# EasyEDA schematic Grafiskas_plates_shema_ZPD_KB.json
TITLE: Ģitāras pedāļa grafiskās shēmas; REV: 1.0; Date: 2023-10-24; Sheet: 1/1; Drawn By: kristapsB; Company: Kristaps Bukšs
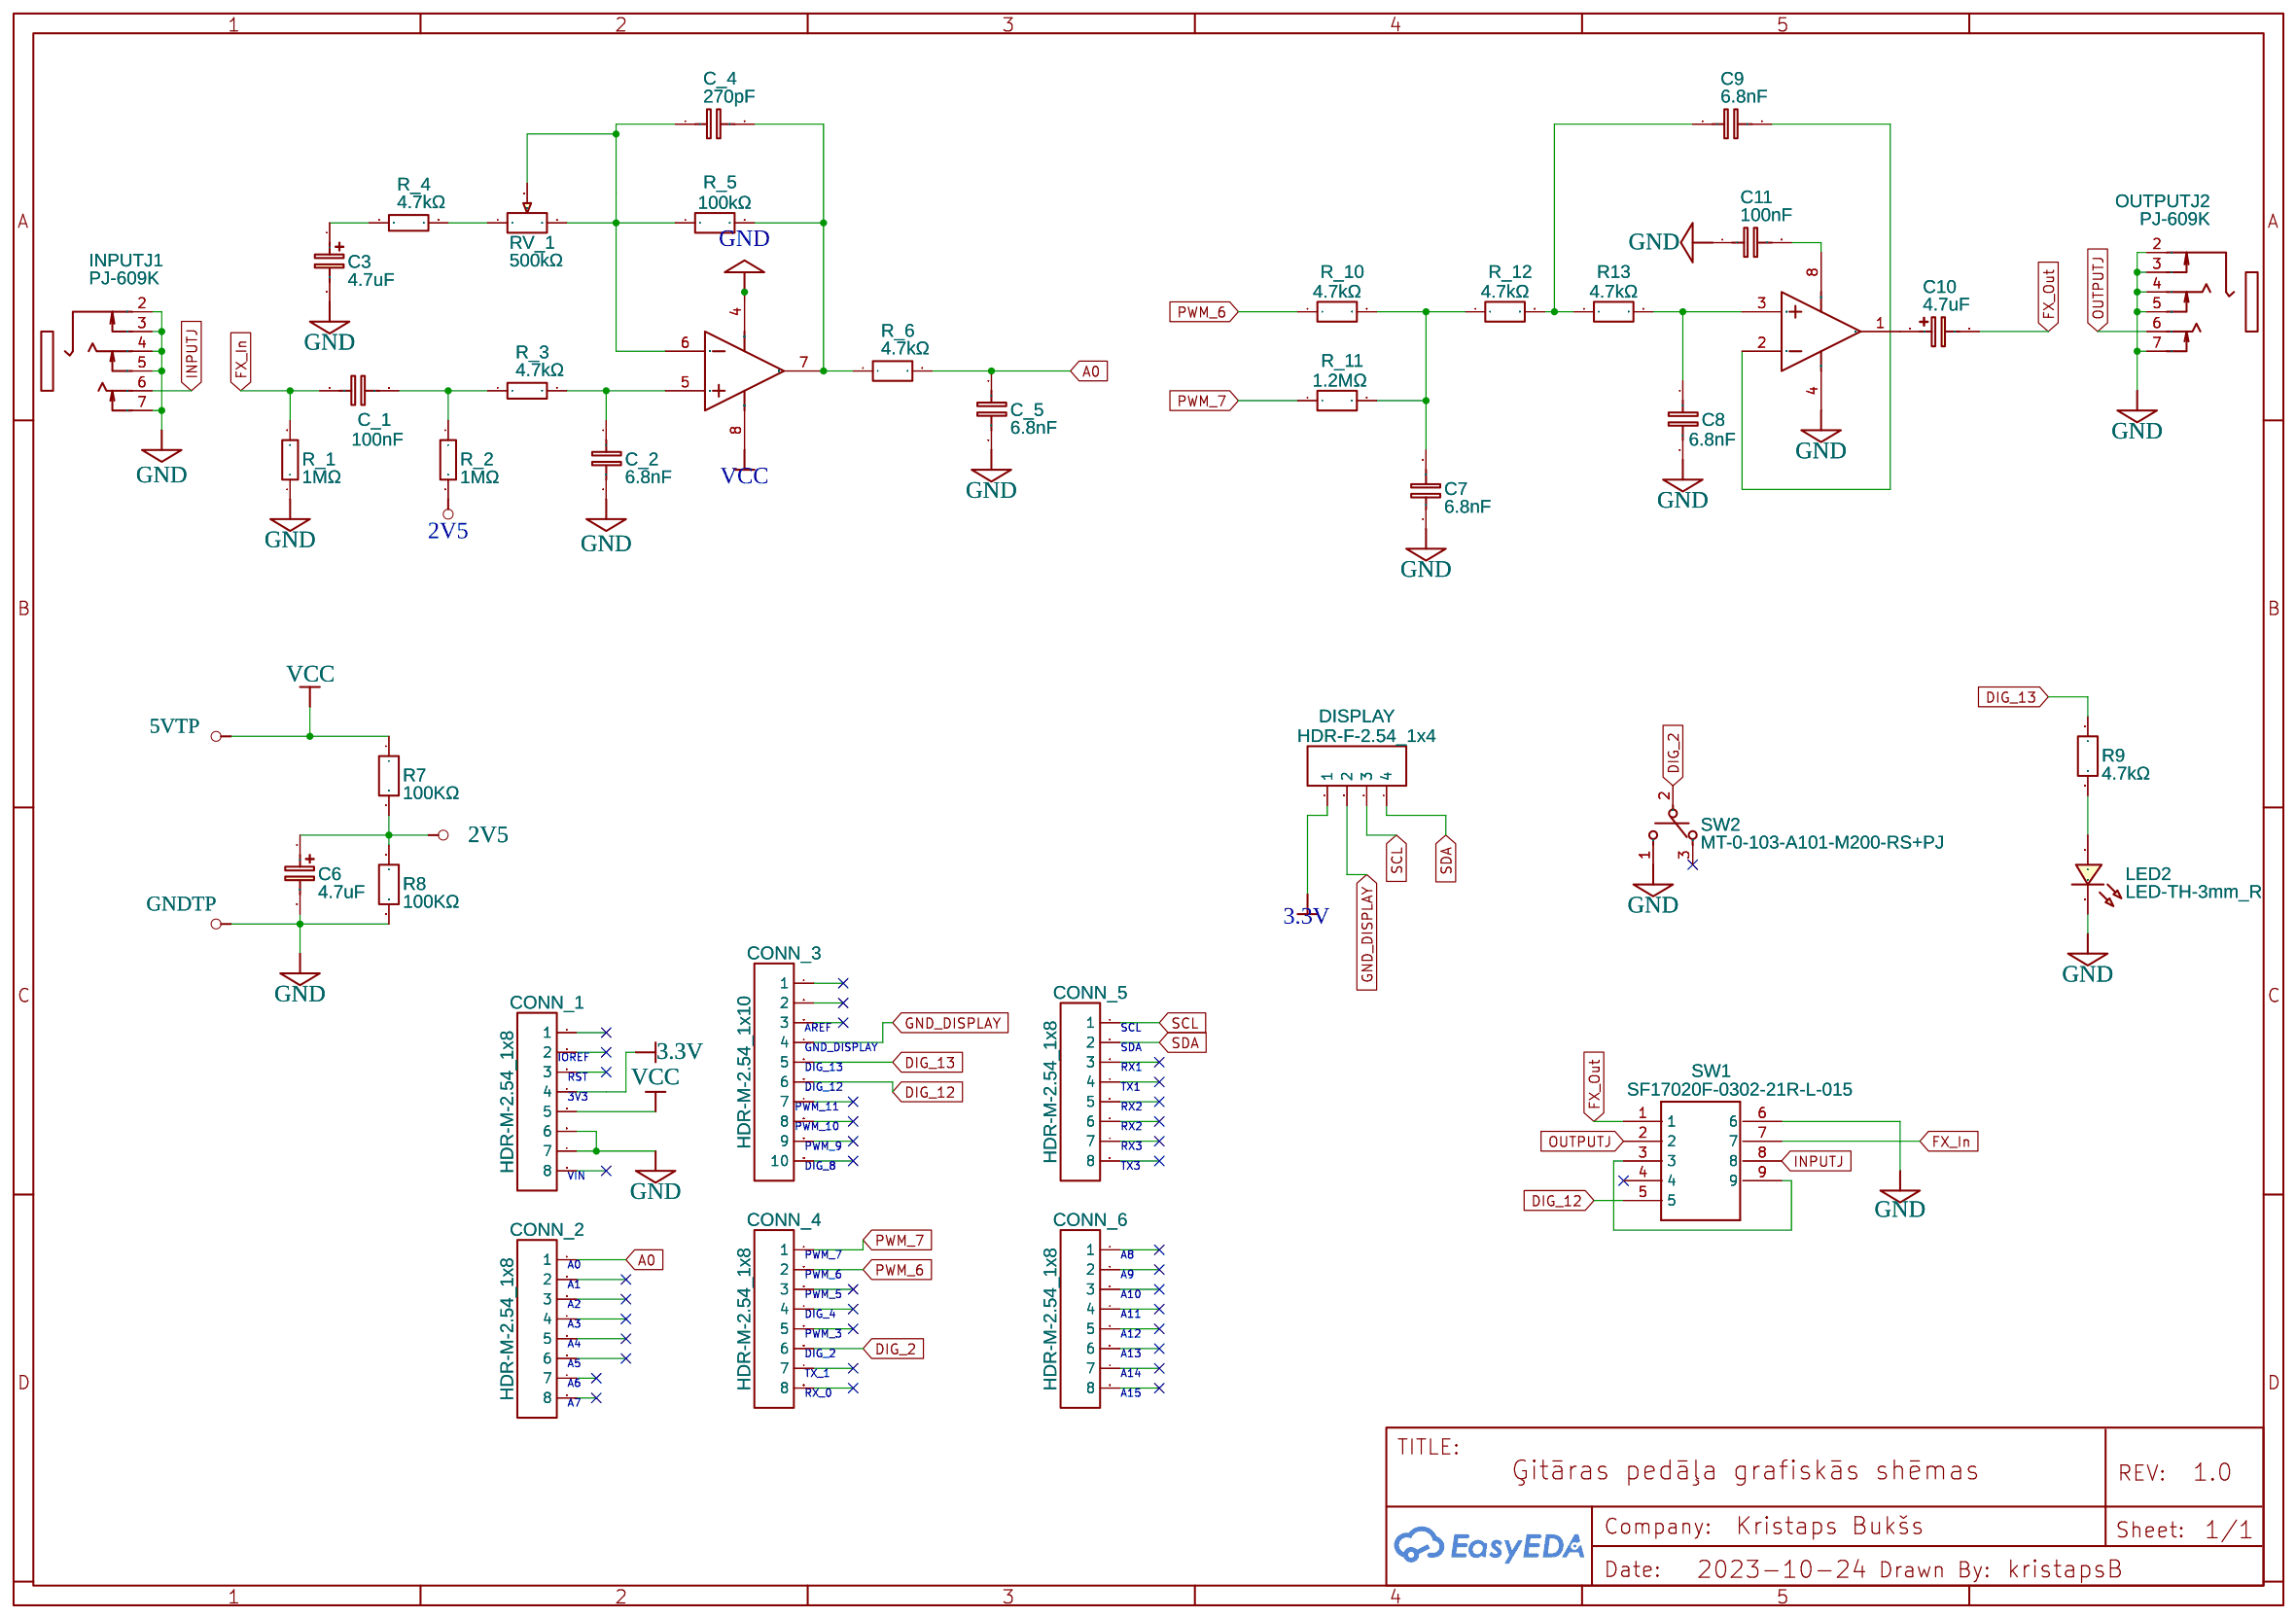
[diagram p0: schematic sheet]

## Parts
C3  4.7uF  [CAP-D6.3×H5.5]
C6  4.7uF  [CAP-D6.3×H5.5]
C7  6.8nF  [C0603]
C8  6.8nF  [C0603]
C9  6.8nF  [C0603]
C10  4.7uF  [CAP-D6.3×H5.5]
C11  100nF  [C0603]
C_1  100nF  [C0603]
C_2  6.8nF  [C0603]
C_4  270pF  [C0603]
C_5  6.8nF  [C0603]
CONN_1  HDR-M-2.54_1x8  [HDR-M-2.54_1X8]
CONN_2  HDR-M-2.54_1x8  [HDR-M-2.54_1X8]
CONN_3  HDR-M-2.54_1x10  [HDR-M-2.54_1X10]
CONN_4  HDR-M-2.54_1x8  [HDR-M-2.54_1X8]
CONN_5  HDR-M-2.54_1x8  [HDR-M-2.54_1X8]
CONN_6  HDR-M-2.54_1x8  [HDR-M-2.54_1X8]
DISPLAY  HDR-F-2.54_1x4  [HDR-F-2.54_1X4]
INPUTJ1  PJ-609K  [AUDIO-TH_PJ-609K]
LED2  LED-TH-3mm_R  [LED-TH_BD3.0_RED]
OUTPUTJ2  PJ-609K  [AUDIO-TH_PJ-609K]
R7  100KΩ  [R0603]
R8  100KΩ  [R0603]
R9  4.7kΩ  [R0603]
R13  4.7kΩ  [R0603]
R_1  1MΩ  [R0603]
R_2  1MΩ  [R0603]
R_3  4.7kΩ  [R0603]
R_4  4.7kΩ  [R0603]
R_5  100kΩ  [R0603]
R_6  4.7kΩ  [R0603]
R_10  4.7kΩ  [R0603]
R_11  1.2MΩ  [R0603]
R_12  4.7kΩ  [R0603]
RV_1  500kΩ  [RES-ADJ-TH_3386P]
SW1  SF17020F-0302-21R-L-015  [SF17020F030221RL015]
SW2  MT-0-103-A101-M200-RS+PJ  [SW-TH_MT-0-103-A101-M200-RS]
U5  TL972IPE4  [DIP8]  (sections 1,2)

## Library data of the parts
C3 C6 C10 = CE_SMD_D6.3×H5.5_EU: Contributor: LCEDA_Lib; Supplier Part: C111600; Supplier: LCSC; Manufacturer Part: UWX1C101MCL1GB; Manufacturer: Nichicon(尼吉康)
C7-C9 = C_0603_EU: Supplier Part: C2835383; Supplier: LCSC; Contributor: LCEDA_Lib; Manufacturer Part: CGA3E2C0G1H682JT0Y0N; Manufacturer: TDK
C11 C_1 = C_0603_EU: Supplier Part: C24452; Supplier: LCSC; Contributor: LCEDA_Lib; Manufacturer Part: CL10B104JB8NNNC; Manufacturer: SAMSUNG(三星)
C_2 C_5 = C_0603_EU: Supplier Part: C432939; Supplier: LCSC; Contributor: LCEDA_Lib; Manufacturer Part: CGA3E1C0G2A682JT0Y0E; Manufacturer: TDK
C_4 = C_0603_EU: Supplier Part: C376824; Supplier: LCSC; Contributor: LCEDA_Lib; Manufacturer Part: TCC0603X7R271K500CT; Manufacturer: CCTC(三环)
CONN_1 CONN_2 CONN_4-CONN_6 = HDR-M-2.54_1x8: Supplier Part: C190820; Supplier: LCSC; Contributor: LCEDA_Lib
CONN_3 = HDR-M-2.54_1x10: Supplier Part: C57369; Supplier: LCSC; Contributor: LCEDA_Lib
DISPLAY = HDR-F-2.54_1x4: Supplier Part: C225501; Supplier: LCSC; Contributor: LCEDA_Lib
INPUTJ1 OUTPUTJ2 = PJ-609K: Contributor: LCSC; Supplier: LCSC; Supplier Part: C309276; Manufacturer: HOOYA; JLCPCB Part Class: Extended Part; link: https://lcsc.com/eda_search?q=C309276&%26type=1&ref=editor
LED2 = LED-TH-3mm_R: Manufacturer: EVERLIGHT(台湾亿光); Manufacturer Part: 204-10SDRD/S530-A3-L; Supplier Part: C84774; Supplier: LCSC; Contributor: LCEDA_Lib
R7 R8 = R_0603_EU: Supplier Part: C312247; Supplier: LCSC; Contributor: LCEDA_Lib; Manufacturer Part: RTT031003BTP; Manufacturer: RALEC(旺诠)
R9 R13 R_10 R_12 = R_0603_EU: Supplier Part: C2904521; Supplier: LCSC; Contributor: LCEDA_Lib; Manufacturer Part: HoLTT0603-1/10W-4.7K-1%; Manufacturer: Milliohm(毫欧)
R_1 R_2 = 0603WAF1004T5E: Supplier: LCSC; Manufacturer: YAGEO(国巨); Manufacturer Part: RC0603JR-071ML; Supplier Part: C107698; JLCPCB Part Class: Basic Part; link: https://lcsc.com/eda_search?q=C22935&%26type=1&ref=editor
R_3 R_4 = 0603WAF4701T5E: Supplier: LCSC; Manufacturer: Milliohm(毫欧); Manufacturer Part: HoLTT0603-1/10W-4.7K-1%; Supplier Part: C2904521; JLCPCB Part Class: Basic Part; link: https://lcsc.com/eda_search?q=C23162&%26type=1&ref=editor
R_5 = SCR0603F100K: Contributor: lcsc; Supplier: LCSC; Supplier Part: C312247; Manufacturer: RALEC(旺诠); Manufacturer Part: RTT031003BTP; JLCPCB Part Class: Extended Part; link: https://lcsc.com/eda_search?q=C3016388&%26type=1&ref=editor
R_6 = R_0603_EU: Contributor: LCEDA_Lib
R_11 = R_0603_EU: Supplier Part: C228147; Supplier: LCSC; Contributor: LCEDA_Lib; Manufacturer Part: AC0603JR-071M2L; Manufacturer: YAGEO(国巨)
RV_1 = R_3386P_EU: Supplier Part: C72529; Supplier: LCSC; Manufacturer Part: 3362P-1-504LF; Contributor: LCEDA_Lib; Value(Ω): 10K; Manufacturer: BOURNS
SW1 = SF17020F-0302-21R-L-015: Contributor: kristaps1
SW2 = MT-0-103-A101-M200-RS+PJ: Contributor: LCSC; Supplier: LCSC; Supplier Part: C1788493; Manufacturer: YUEN FUNG(源丰); JLCPCB Part Class: Extended Part; link: https://lcsc.com/eda_search?q=C1788493&%26type=1&ref=editor
U5 = TL972IPE4: Output Rail-To-Rail Very-Low-Noise Operational Amplifier, 2.7 to 12 V, -40 to 125 degC, 8-pin DIP (P8), Pb-Free (RoHS); subpart_no: 1

## Nets
2V5: C6.1 R7.2 R8.1 R_2.2
3.3V: CONN_1.4 DISPLAY.1
5VTP: CONN_1.5 R7.1
GND: C3.2 C6.2 C7.1 C8.2 C11.1 C_2.2 C_5.2 CONN_1.6 CONN_1.7 INPUTJ1.2 INPUTJ1.3 INPUTJ1.4 INPUTJ1.5 INPUTJ1.7 LED2.2 OUTPUTJ2.2 OUTPUTJ2.3 OUTPUTJ2.4 OUTPUTJ2.5 OUTPUTJ2.7 R8.2 R_1.1 SW1.6 SW2.1 U5.4(VCC+)
GND_DISPLAY: CONN_3.4 DISPLAY.2
A0: C_5.1 CONN_2.1 R_6.2
DIG_2: CONN_4.6 SW2.2
DIG_12: CONN_3.6 SW1.5
DIG_13: CONN_3.5 R9.1
FX_In: C_1.1 R_1.2 SW1.7
FX_Out: C10.2 SW1.1
INPUTJ: INPUTJ1.6 SW1.8
OUTPUTJ: OUTPUTJ2.6 SW1.2
PWM_6: CONN_4.2 R_10.1
PWM_7: CONN_4.1 R_11.1
SCL: CONN_5.1 DISPLAY.3
SDA: CONN_5.2 DISPLAY.4
Net-(C3-1): C3.1 R_4.1
Net-(C7-2): C7.2 R_10.2 R_11.2 R_12.1
Net-(C8-1): C8.1 R13.2 U5.3(IN1+)
Net-(C9-1): C9.1 R13.1 R_12.2
Net-(C9-2): C9.2 U5.2(IN1-)
Net-(C10-1): C10.1 U5.1(OUT1)
Net-(C11-2): C11.2 U5.8(VCC-)
Net-(C_1-2): C_1.2 R_2.1 R_3.1
Net-(C_2-1): C_2.1 R_3.2 U5.5(IN2+)
Net-(C_4-1): C_4.1 R_5.1 RV_1.2 RV_1.3 U5.6(IN2-)
Net-(C_4-2): C_4.2 R_5.2 R_6.1 U5.7(OUT2)
Net-(LED2-1): LED2.1 R9.2
Net-(R_4-2): R_4.2 RV_1.1
Net-(SW1-3): SW1.3 SW1.9

Not connected (* = marked no-connect by the designer): CONN_1 1 2 3 8; CONN_2 2 3 4 5 6 7 8; CONN_3 1 2 3 7 8 9 10; CONN_4 3 4 5 7 8; CONN_5 3 4 5 6 7 8; CONN_6 1 2 3 4 5 6 7 8; SW1 4*; SW2 3*

## Notes on the sheet
- AREF
- SCL
- GND_DISPLAY
- SDA
- IOREF
- RST
- DIG_13
- RX1
- 3V3
- DIG_12
- TX1
- PWM_11
- RX2
- PWM_10
- PWM_9
- RX2
- RX3
- DIG_8
- TX3
- VIN
- A0
- PWM_7
- A8
- A1
- PWM_6
- A9
- A2
- PWM_5
- A10
- A3
- DIG_4
- PWM_3
- A11
- A12
- A4
- DIG_2
- A13
- A5
- TX_1
- A14
- A6
- A7
- RX_0
- A15
